# Altium schematic sheet 03. Power.SchDoc
size A3
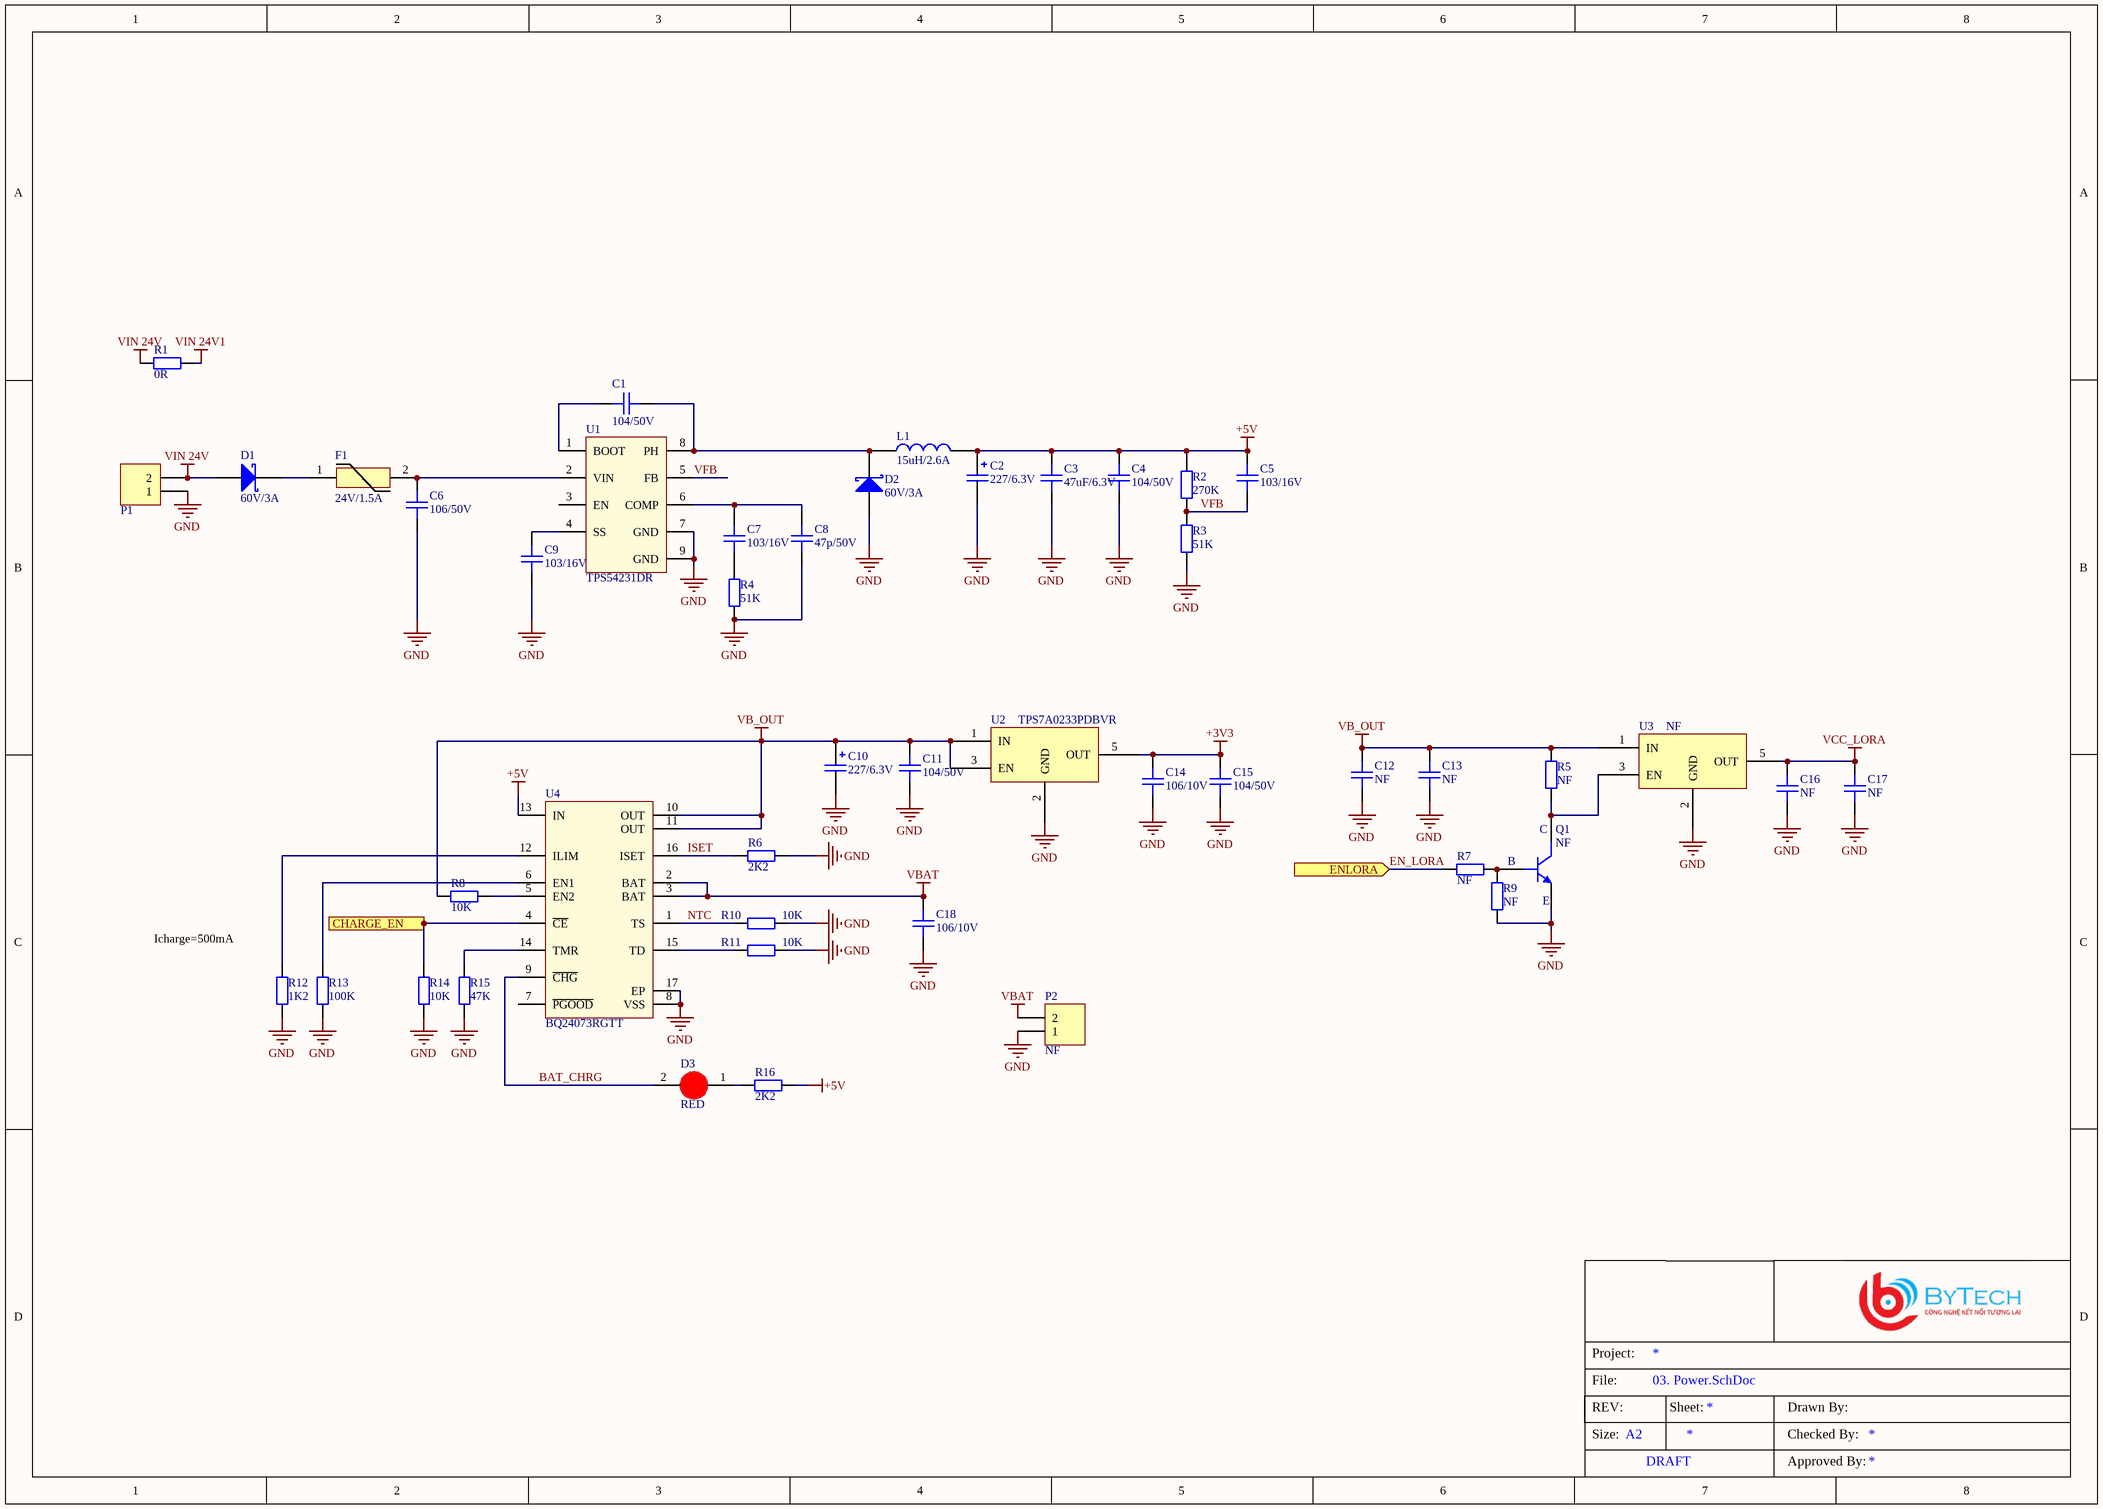
[diagram p0: 03. Power.SchDoc]

## Parts
C1  104/50V  [CAPC-0603 (1608)]
C2  227/6.3V  [CAP_TANTAL_1210(3528)]
C3  47uF/6.3V  [CAPC-0603 (1608)]
C4  104/50V  [CAPC-0603 (1608)]
C5  103/16V  [CAPC-0603 (1608)]
C6  106/50V  [CAPC-1210 (3225)]
C7  103/16V  [CAPC-0603 (1608)]
C8  47p/50V  [CAPC-0603 (1608)]
C9  103/16V  [CAPC-0603 (1608)]
C10  227/6.3V  [CAP_TANTAL_1210(3528)]
C11  104/50V  [CAPC-0603 (1608)]
C12  NF  [CAPC-0603 (1608)]
C13  NF  [CAPC-0603 (1608)]
C14  106/10V  [CAPC-0603 (1608)]
C15  104/50V  [CAPC-0603 (1608)]
C16  NF  [CAPC-0603 (1608)]
C17  NF  [CAPC-0603 (1608)]
C18  106/10V  [CAPC-0603 (1608)]
D1  60V/3A  [DIODE_DO214AC_SMA]
D2  60V/3A  [DIODE_DO214AC_SMA]
D3  RED  [LED 0603]
F1  24V/1.5A  [FUSE_1812(4532)]
L1  15uH/2.6A  [IND-74404084150]
P1  15EDG3.81-2P  [HDR_3.81MM_RA_2x1]  (value not drawn)
P2  NF  [XH2.54-2P]
Q1  NF  [SOT23_3]
R1  0R  [RESC-0603 (1608)]
R2  270K  [RESC-0603 (1608)]
R3  51K  [RESC-0603 (1608)]
R4  51K  [RESC-0603 (1608)]
R5  NF  [RESC-0603 (1608)]
R6  2K2  [RESC-0603 (1608)]
R7  NF  [RESC-0603 (1608)]
R8  10K  [RESC-0603 (1608)]
R9  NF  [RESC-0603 (1608)]
R10  10K  [RESC-0603 (1608)]
R11  10K  [RESC-0603 (1608)]
R12  1K2  [RESC-0603 (1608)]
R13  100K  [RESC-0603 (1608)]
R14  10K  [RESC-0603 (1608)]
R15  47K  [RESC-0603 (1608)]
R16  2K2  [RESC-0603 (1608)]
U1  TPS54231DR  [SOIC8 - TP]
U2  TPS7A0233PDBVR  [SOT23-5]
U3  NF  [SOT23-5]
U4  BQ24073RGTT  [RGT16-1700X1700TP]

## Ports
CHARGE_EN (in), ENLORA (in)

## Nets
+3V3: C14.2 C15.2 U2.5(OUT)
+5V: C2.1 C3.2 C4.2 C5.2 L1.2 R2.2 R16.2 U4.13(IN)
GND: C2.2 C3.1 C4.1 C6.1 C8.1 C9.2 C10.2 C11.1 C12.1 C13.1 C14.1 C15.1 C16.1 C17.1 C18.1 D2.1(A) P1.1 P2.1 Q1.2(E) R3.1 R4.1 R6.2 R9.1 R10.2 R11.2 R12.1 R13.1 R14.1 R15.1 U1.7(GND) U1.9(GND) U2.2(GND) U3.2(GND) U4.8(VSS) U4.17(EP)
VB_OUT: C10.1 C11.2 C12.2 C13.2 R5.2 R8.1 U2.1(IN) U2.3(EN) U3.1(IN) U4.10(OUT) U4.11(OUT)
VBAT: C18.2 P2.2 U4.2(BAT) U4.3(BAT)
VCC_LORA: C16.2 C17.2 U3.5(OUT)
VIN 24V: D1.1(A) P1.2 R1.1
VIN 24V1: R1.2
BAT_CHRG: D3.2(K) U4.9(~{CHG})
CHARGE_EN: R14.2 U4.4(~{CE}) ; port CHARGE_EN
EN_LORA: R7.1 ; port ENLORA
ISET: R6.1 U4.16(ISET)
NTC: R10.1 U4.1(TS)
VFB: C5.1 R2.1 R3.2 U1.5(FB)
NetC1_1: C1.1 U1.1(BOOT)
NetC1_2: C1.2 D2.2(K) L1.1 U1.8(PH)
NetC6_2: C6.2 F1.2 U1.2(VIN)
NetC7_1: C7.1 C8.2 U1.6(COMP)
NetC7_2: C7.2 R4.2
NetC9_1: C9.1 U1.4(SS)
NetD1_2: D1.2(K) F1.1
NetD3_1: D3.1(A) R16.1
NetQ1_1: Q1.1(B) R7.2 R9.2
NetQ1_3: Q1.3(C) R5.1 U3.3(EN)
NetR8_2: R8.2 U4.5(EN2)
NetR11_1: R11.1 U4.15(TD)
NetR12_2: R12.2 U4.12(ILIM)
NetR13_2: R13.2 U4.6(EN1)
NetR15_2: R15.2 U4.14(TMR)

Not connected (* = marked no-connect by the designer): U1 3(EN); U4 7(~{PGOOD})

## Notes on the sheet
- (near R12) Icharge=500mA
- File:
- Project:
- REV:
- Size:
- A2
- Sheet:
- Drawn By:
- Checked By:
- DRAFT
- Approved By:

## Library data of the parts
C1 C4 C11 C15 = C0603C104K5RACTU: CAP CER 0.1uF 50V 10% X7R 0603; CompanyID: VT-00982; Solder: SMT; MPN: C0603C104K5RACTU; Value: 104/50V; Category: CAPACITOR
C2 = T520B227M006ATE035: CAP TANT POLY 220uF 20% 6.3V 3528 35mOhm ESR; Solder: SMT; CompanyID: VT-00643; Value: 227/6.3V; MPN: T520B227M006ATE035
C3 = GRM188R60J476ME15D: CAP CER 47UF 6.3V X5R 0603; MFR: Murata Electronics; MPN: GRM188R60J476ME15D; Value: 47uF/6.3V; Category: CAPACITOR; SOLDER: CAP-0603
C5 = CC0603KRX7R7BB103: CAP CER 10nF 16V 10% X7R 0603; CompanyID: VT-00592; Solder: SMT; MPN: CC0603KRX7R7BB103; Value: 103/16V; Category: CAPACITOR
C6 = GRM32ER71H106KA12L: CAP CER 10uF 10% 50V X7R 1210 (3255); CompanyID: VT-01019; Solder: SMT; Value: 106/50V; MPN: GRM32ER71H106KA12L; Category: CAPACITOR
C7 C9 = CC0603KRX7R7BB103: CAP CER 10nF 16V 10% X7R 0603; Solder: SMT; Company ID: VT00031; MPN: CC0603KRX7R7BB103; Value: 103/16V
C8 = CL10C470JB8NNNC: CAP CER 47pF 5% 50V C0G/NP0 0603; Solder: SMT; MPN: CL10C470JB8NNNC; Value: 47p/50V
C10 = T520B227M006ATE035: CAP TANT POLY 220uF 20% 6.3V 3528 35mOhm ESR; Solder: SMT; Company ID: VT00099; Value: 227/6.3V; MPN: T520B227M006ATE035
C12 C16 = CL10A106KP8NNNC: CAP CER 10uF 10% 10V X5R 0603; Solder: SMT; Value: 106/10V; MPN: CL10A106KP8NNNC
C13 C17 = C0603C104K5RACTU: CAP CER 0.1uF 50V 10% X7R 0603; CompanyID: VT-00982; Solder: SMT; Value: 104/50V; MPN: C0603C104K5RACTU; Category: CAPACITOR
C14 = CL10A106KP8NNNC: CAP CER 10uF 10% 10V X5R 0603; Solder: SMT; MPN: CL10A106KP8NNNC; Value: 106/10V
C18 = CL10A106KP8NNNC: CAP CER 10uF 10% 10V X5R 0603; CompanyID: VT-00984; Solder: SMT; MPN: CL10A106KP8NNNC; Value: 106/10V
D1 = SK36A-LTP: DIODE SCHOTTKY 60V 3A DO214AC; MPN: SK36A-LTP; Category: Diode; Solder: DO214AC; Value: 60V/3A
D2 = SK36A-LTP: DIODE SCHOTTKY 60V 3A DO214AC; Manufacturer: Micro Commercial Co; MPN: SK36A-LTP; Category: Diode; Solder: DO214AC; Value: 60V/3A
D3 = LED 0603 RED: Solder: 0603; Company ID: VT00361; MPN: LED 0603 RED; Category: LED Diode; Value: RED
F1 = 1812L150/24MR: FUSE PTC RESETTABLE 24V 1.50A 1812L; Solder: SMT; MPN: 1812L150/24MR; Value: 24V/1.5A
L1 = 74404084150: FIXED IND 15UH 2.6A 47 MOHM SMD; MFR: Würth Elektronik; Company ID: VT00316; MPN: 74404084150; VALUE: 15uH/2.6A; CATEGORY: INDUCTOR
P1 = 15EDG3.81-2P: Pluggable terminal 15EDG- 2P 3.81MM; MFR: China; Solder: Hand; MPN: 15EDG3.81-2P; Value: 15EDG3.81-2P; Company ID: *; MPN2: CLA5048
P2 = XH-2A: XH2.54mmm - 2P 180 degree; MPN: XH-2A; Value: XH2.54mm
Q1 = 2SC1815: TRANS NPN 50V 0.15A SOT23-3; Solder: SMT; Company ID: VT00492; MPN: 2SC1815; Value: 2SC1815; Category: Transistor
R1 = RC0603FR-070R: RES SMD 0 OHM 1% 1/10W 0603; Solder: SMT; Company ID: VT00423; Value: 0R; MPN: RC0603FR-070R
R2 = RT0603BRD07270KL: RES SMD 270K OHM 0.1% 1/10W 0603; Company ID: VT00474; value: 270K; MPN: RT0603BRD07270KL
R3 R4 = RC0603FR-0751KL: RES SMD 51K OHM 1% 1/10W 0603; MFR: Yageo; Company ID: VT00453; Value: 51K; Category: Resistor; MPN: RC0603FR-0751KL; Solder: RES-0603
R5 R9 = RC0603FR-0710KL: RES SMD 10K OHM 1% 1/10W 0603; Solder: SMT; Company ID: VT00426; MPN: RC0603FR-0710KL; Value: 10K
R6 R16 = CRCW06032K20FKEA: RES SMD 2.2K OHM 1% 1/10W 0603; Solder: SMT; Company ID: VT00406; MPN: CRCW06032K20FKEA; Value: 2K2
R7 = RC0603FR-071KL: RES SMD 1 KOHM 1% 1/10W 0603; Solder: SMT; Value: 1K; Company ID: VT00433; MPN: RC0603FR-071KL
R8 R10 R11 R14 = RC0603FR-0710KL: RES SMD 10K OHM 1% 1/10W 0603; CompanyID: VT-00328; Solder: SMT; MPN: RC0603FR-0710KL; Value: 10K
R12 = RC0603FR-071K2L: RES SMD 1.2K OHM 1% 1/10W 0603; CompanyID: VT-01075; Solder: SMT; Value: 1K2; MPN: RC0603FR-071K2L
R13 = RC0603FR-07100KL: RES SMD 100K OHM 1% 1/10W 0603; Solder: SMT; CompanyID: VT-00332; MPN: RC0603FR-07100KL; Value: 100K
R15 = RC0603FR0747KL: RES SMD 47K OHM 1% 1/10W 0603; CompanyID: VT-00322; Solder: SMT; Value: 47K; MPN: RC0603FR0747KL
U1 = TPS54231DR: IC REG BUCK ADJUSTABLE 2A 8SOIC; MFR: TI; SOLDER: SOIC8; MPN: TPS54231DR; CATEGORY: IC; VALUE: TPS54231DR
U2 U3 = TPS7A0233PDBVR: NANOPOWER LDO; Current - Quiescent: 60nA; MPN: TPS7A0233PDBVR; Category: IC; Solder: SOT23-5; Value: TPS7A0233PDBVR
U4 = BQ24073RGTT: IC LI-ION CHARGE/PWR MGMT 16-QFN; MFR: Texas Instruments; Solder: 16-QFN (3x3); Company ID: VT00206; MPN: BQ24073RGTT; Category: IC; Value: BQ24073RGTT